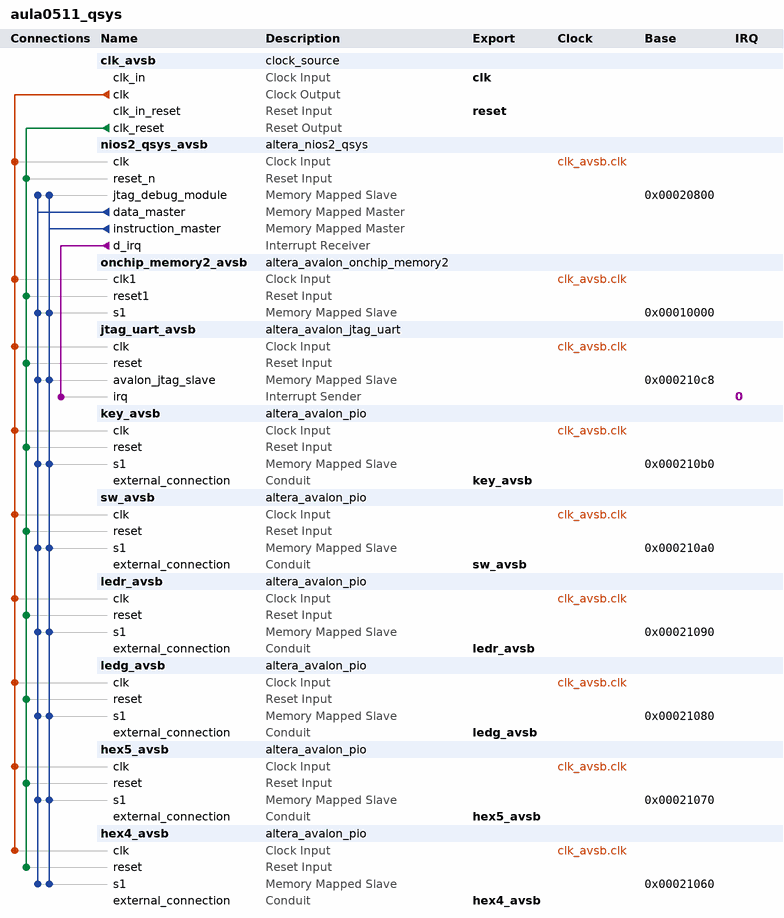
[diagram p0: system contents]
# Platform Designer (Qsys) system aula0511_qsys, Cyclone II EP2C35F672C6
# Parameters at their usual value, and those the tool derives, are not listed.
package require -exact qsys 13.0.1.99.2
create_system aula0511_qsys
set_project_property DEVICE_FAMILY {Cyclone II}
set_project_property DEVICE EP2C35F672C6

add_instance clk_avsb clock_source 13.0
set_instance_parameter_value clk_avsb clockFrequency 50000000

add_instance nios2_qsys_avsb altera_nios2_qsys 13.0
set_instance_parameter_value nios2_qsys_avsb resetSlave onchip_memory2_avsb.s1
set_instance_parameter_value nios2_qsys_avsb mmu_TLBMissExcSlave None
set_instance_parameter_value nios2_qsys_avsb exceptionSlave onchip_memory2_avsb.s1
set_instance_parameter_value nios2_qsys_avsb breakSlave nios2_qsys_avsb.jtag_debug_module
set_instance_parameter_value nios2_qsys_avsb impl Tiny
set_instance_parameter_value nios2_qsys_avsb icache_size 4096

add_instance onchip_memory2_avsb altera_avalon_onchip_memory2 13.0.1.99.2
set_instance_parameter_value onchip_memory2_avsb dataWidth 32
set_instance_parameter_value onchip_memory2_avsb dualPort false
set_instance_parameter_value onchip_memory2_avsb initMemContent true
set_instance_parameter_value onchip_memory2_avsb initializationFileName onchip_mem.hex
set_instance_parameter_value onchip_memory2_avsb memorySize 40960

add_instance jtag_uart_avsb altera_avalon_jtag_uart 13.0.1.99.2
set_instance_parameter_value jtag_uart_avsb simInteractiveOptions NO_INTERACTIVE_WINDOWS

add_instance key_avsb altera_avalon_pio 13.0.1.99.2
set_instance_parameter_value key_avsb direction Input
set_instance_parameter_value key_avsb width 4

add_instance sw_avsb altera_avalon_pio 13.0.1.99.2
set_instance_parameter_value sw_avsb direction Input
set_instance_parameter_value sw_avsb width 8

add_instance ledr_avsb altera_avalon_pio 13.0.1.99.2
set_instance_parameter_value ledr_avsb direction Output
set_instance_parameter_value ledr_avsb width 8

add_instance ledg_avsb altera_avalon_pio 13.0.1.99.2
set_instance_parameter_value ledg_avsb direction Output
set_instance_parameter_value ledg_avsb width 8

add_instance hex5_avsb altera_avalon_pio 13.0.1.99.2
set_instance_parameter_value hex5_avsb direction Output
set_instance_parameter_value hex5_avsb width 7

add_instance hex4_avsb altera_avalon_pio 13.0.1.99.2
set_instance_parameter_value hex4_avsb direction Output
set_instance_parameter_value hex4_avsb width 7

# connections
add_connection clk_avsb.clk hex4_avsb.clk clock
add_connection clk_avsb.clk hex5_avsb.clk clock
add_connection clk_avsb.clk jtag_uart_avsb.clk clock
add_connection clk_avsb.clk key_avsb.clk clock
add_connection clk_avsb.clk ledg_avsb.clk clock
add_connection clk_avsb.clk ledr_avsb.clk clock
add_connection clk_avsb.clk nios2_qsys_avsb.clk clock
add_connection clk_avsb.clk onchip_memory2_avsb.clk1 clock
add_connection clk_avsb.clk sw_avsb.clk clock
add_connection clk_avsb.clk_reset hex4_avsb.reset reset
add_connection clk_avsb.clk_reset hex5_avsb.reset reset
add_connection clk_avsb.clk_reset jtag_uart_avsb.reset reset
add_connection clk_avsb.clk_reset key_avsb.reset reset
add_connection clk_avsb.clk_reset ledg_avsb.reset reset
add_connection clk_avsb.clk_reset ledr_avsb.reset reset
add_connection clk_avsb.clk_reset nios2_qsys_avsb.reset_n reset
add_connection clk_avsb.clk_reset onchip_memory2_avsb.reset1 reset
add_connection clk_avsb.clk_reset sw_avsb.reset reset
add_connection nios2_qsys_avsb.data_master hex4_avsb.s1 avalon
set_connection_parameter_value nios2_qsys_avsb.data_master/hex4_avsb.s1 baseAddress 0x00021060
add_connection nios2_qsys_avsb.data_master hex5_avsb.s1 avalon
set_connection_parameter_value nios2_qsys_avsb.data_master/hex5_avsb.s1 baseAddress 0x00021070
add_connection nios2_qsys_avsb.data_master jtag_uart_avsb.avalon_jtag_slave avalon
set_connection_parameter_value nios2_qsys_avsb.data_master/jtag_uart_avsb.avalon_jtag_slave baseAddress 0x000210c8
add_connection nios2_qsys_avsb.data_master key_avsb.s1 avalon
set_connection_parameter_value nios2_qsys_avsb.data_master/key_avsb.s1 baseAddress 0x000210b0
add_connection nios2_qsys_avsb.data_master ledg_avsb.s1 avalon
set_connection_parameter_value nios2_qsys_avsb.data_master/ledg_avsb.s1 baseAddress 0x00021080
add_connection nios2_qsys_avsb.data_master ledr_avsb.s1 avalon
set_connection_parameter_value nios2_qsys_avsb.data_master/ledr_avsb.s1 baseAddress 0x00021090
add_connection nios2_qsys_avsb.data_master nios2_qsys_avsb.jtag_debug_module avalon
set_connection_parameter_value nios2_qsys_avsb.data_master/nios2_qsys_avsb.jtag_debug_module baseAddress 0x00020800
add_connection nios2_qsys_avsb.data_master onchip_memory2_avsb.s1 avalon
set_connection_parameter_value nios2_qsys_avsb.data_master/onchip_memory2_avsb.s1 baseAddress 0x00010000
add_connection nios2_qsys_avsb.data_master sw_avsb.s1 avalon
set_connection_parameter_value nios2_qsys_avsb.data_master/sw_avsb.s1 baseAddress 0x000210a0
add_connection nios2_qsys_avsb.instruction_master hex4_avsb.s1 avalon
set_connection_parameter_value nios2_qsys_avsb.instruction_master/hex4_avsb.s1 baseAddress 0x00021060
add_connection nios2_qsys_avsb.instruction_master hex5_avsb.s1 avalon
set_connection_parameter_value nios2_qsys_avsb.instruction_master/hex5_avsb.s1 baseAddress 0x00021070
add_connection nios2_qsys_avsb.instruction_master jtag_uart_avsb.avalon_jtag_slave avalon
set_connection_parameter_value nios2_qsys_avsb.instruction_master/jtag_uart_avsb.avalon_jtag_slave baseAddress 0x000210c8
add_connection nios2_qsys_avsb.instruction_master key_avsb.s1 avalon
set_connection_parameter_value nios2_qsys_avsb.instruction_master/key_avsb.s1 baseAddress 0x000210b0
add_connection nios2_qsys_avsb.instruction_master ledg_avsb.s1 avalon
set_connection_parameter_value nios2_qsys_avsb.instruction_master/ledg_avsb.s1 baseAddress 0x00021080
add_connection nios2_qsys_avsb.instruction_master ledr_avsb.s1 avalon
set_connection_parameter_value nios2_qsys_avsb.instruction_master/ledr_avsb.s1 baseAddress 0x00021090
add_connection nios2_qsys_avsb.instruction_master nios2_qsys_avsb.jtag_debug_module avalon
set_connection_parameter_value nios2_qsys_avsb.instruction_master/nios2_qsys_avsb.jtag_debug_module baseAddress 0x00020800
add_connection nios2_qsys_avsb.instruction_master onchip_memory2_avsb.s1 avalon
set_connection_parameter_value nios2_qsys_avsb.instruction_master/onchip_memory2_avsb.s1 baseAddress 0x00010000
add_connection nios2_qsys_avsb.instruction_master sw_avsb.s1 avalon
set_connection_parameter_value nios2_qsys_avsb.instruction_master/sw_avsb.s1 baseAddress 0x000210a0
add_connection nios2_qsys_avsb.d_irq jtag_uart_avsb.irq interrupt
set_connection_parameter_value nios2_qsys_avsb.d_irq/jtag_uart_avsb.irq irqNumber 0

# exported interfaces
add_interface clk clock sink
set_interface_property clk EXPORT_OF clk_avsb.clk_in
add_interface reset reset sink
set_interface_property reset EXPORT_OF clk_avsb.clk_in_reset
add_interface key_avsb conduit end
set_interface_property key_avsb EXPORT_OF key_avsb.external_connection
add_interface sw_avsb conduit end
set_interface_property sw_avsb EXPORT_OF sw_avsb.external_connection
add_interface ledr_avsb conduit end
set_interface_property ledr_avsb EXPORT_OF ledr_avsb.external_connection
add_interface ledg_avsb conduit end
set_interface_property ledg_avsb EXPORT_OF ledg_avsb.external_connection
add_interface hex5_avsb conduit end
set_interface_property hex5_avsb EXPORT_OF hex5_avsb.external_connection
add_interface hex4_avsb conduit end
set_interface_property hex4_avsb EXPORT_OF hex4_avsb.external_connection

set_interconnect_requirement {$system} qsys_mm.clockCrossingAdapter HANDSHAKE
set_interconnect_requirement {$system} qsys_mm.maxAdditionalLatency 1

save_system aula0511_qsys.qsys
